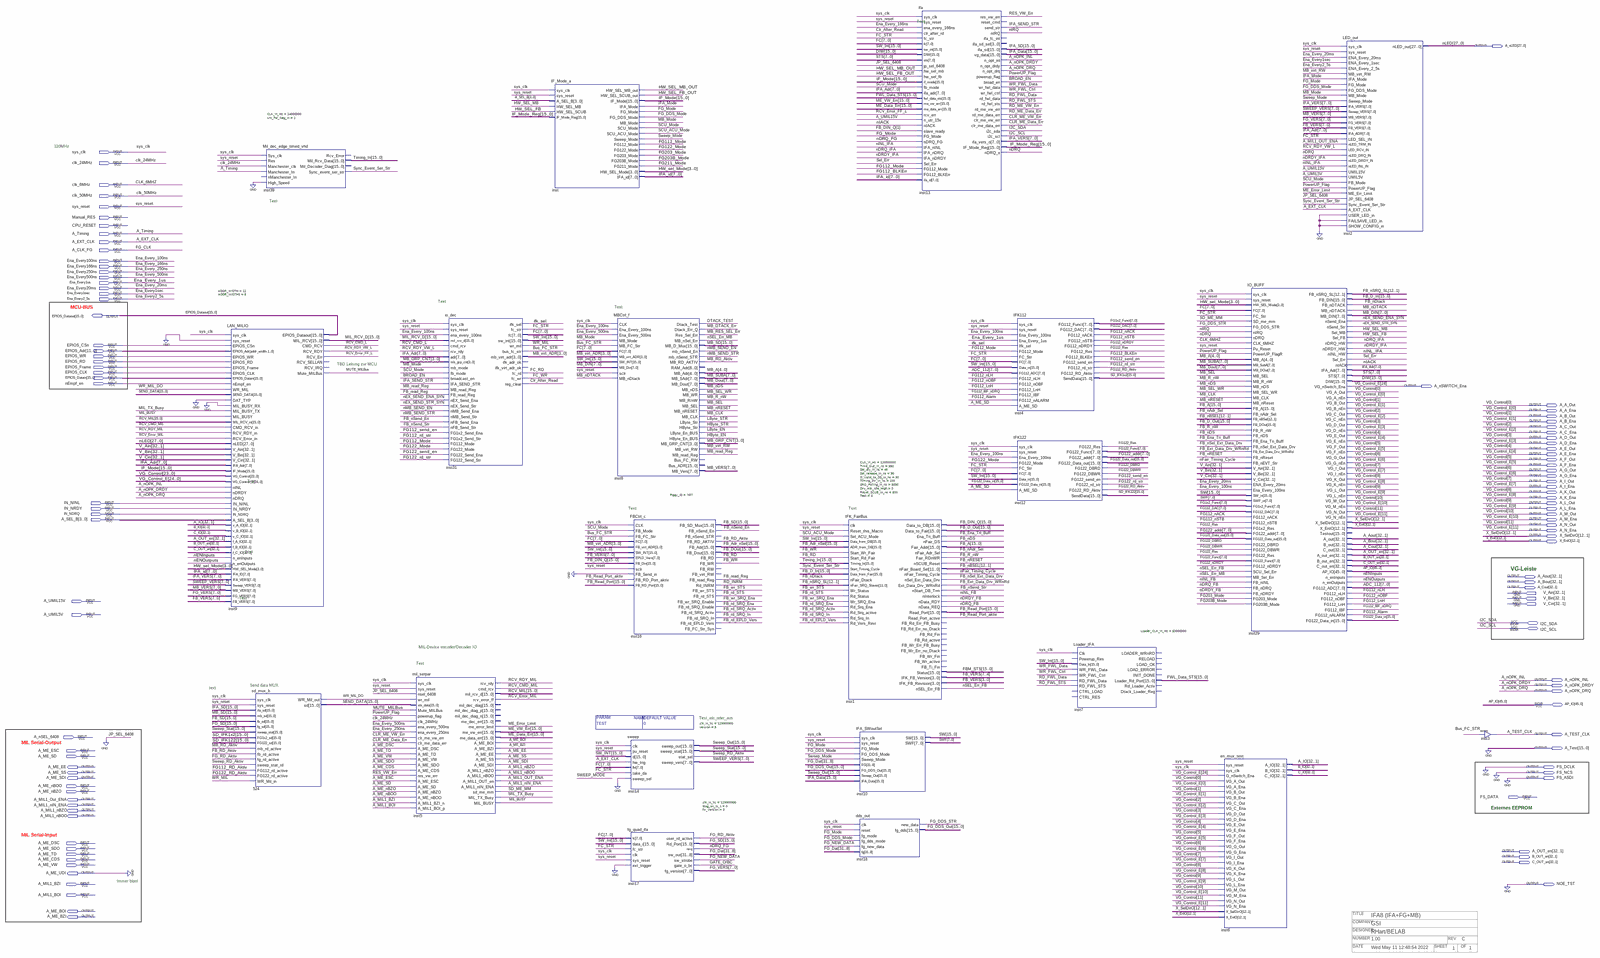
[diagram p0: schematic sheet, whole]
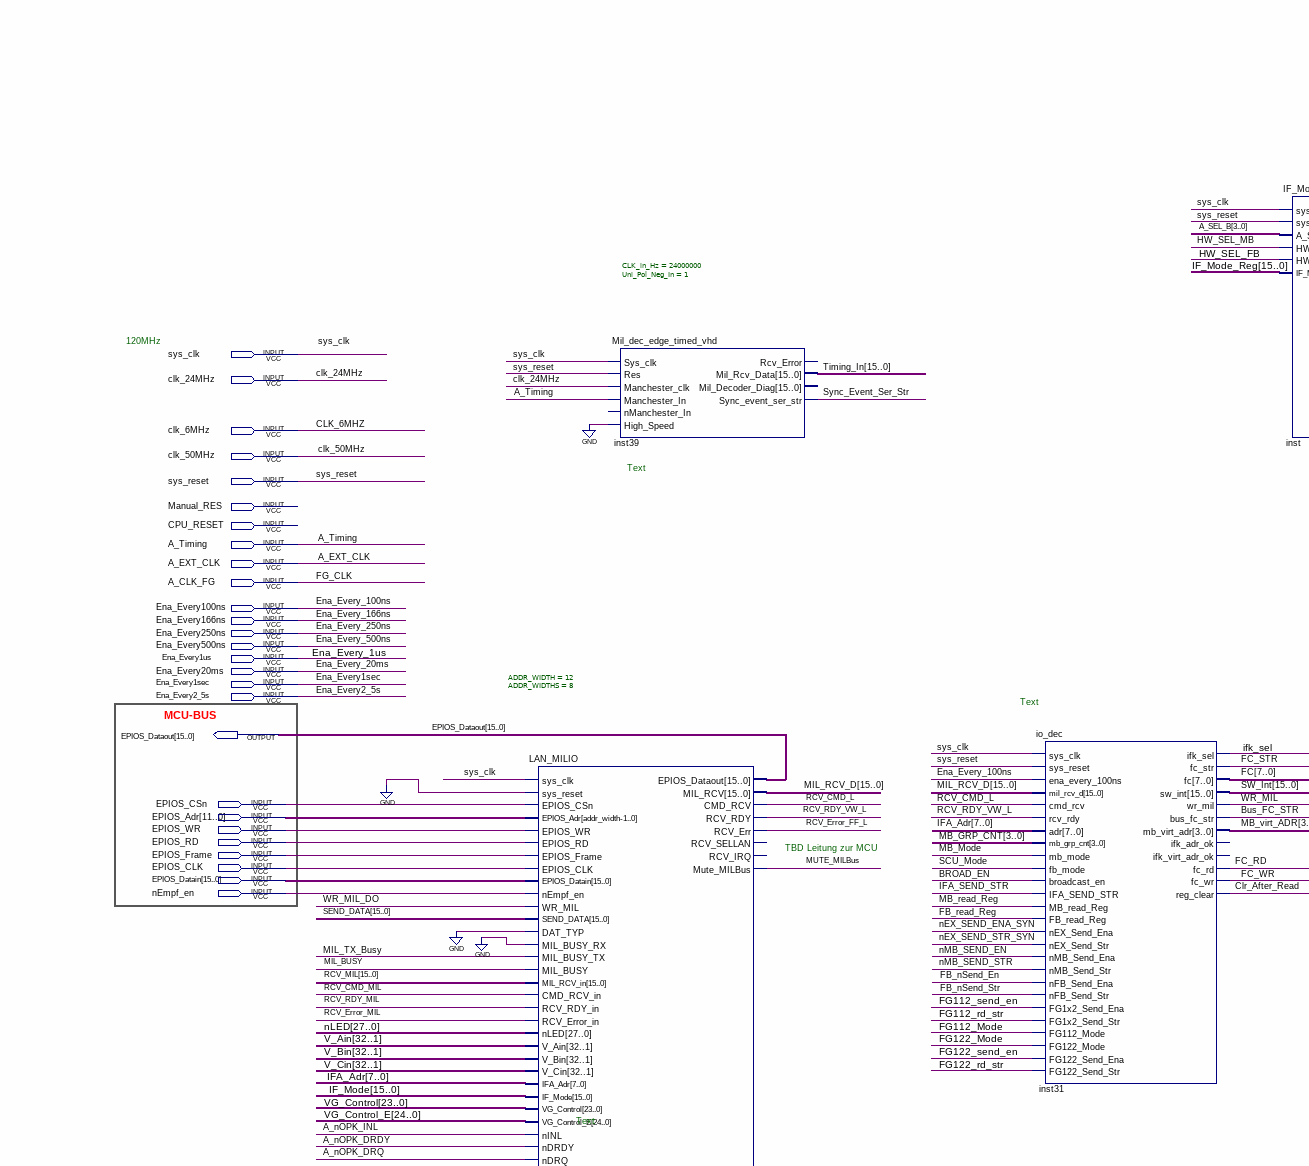
[diagram p1: schematic sheet, upper left part]
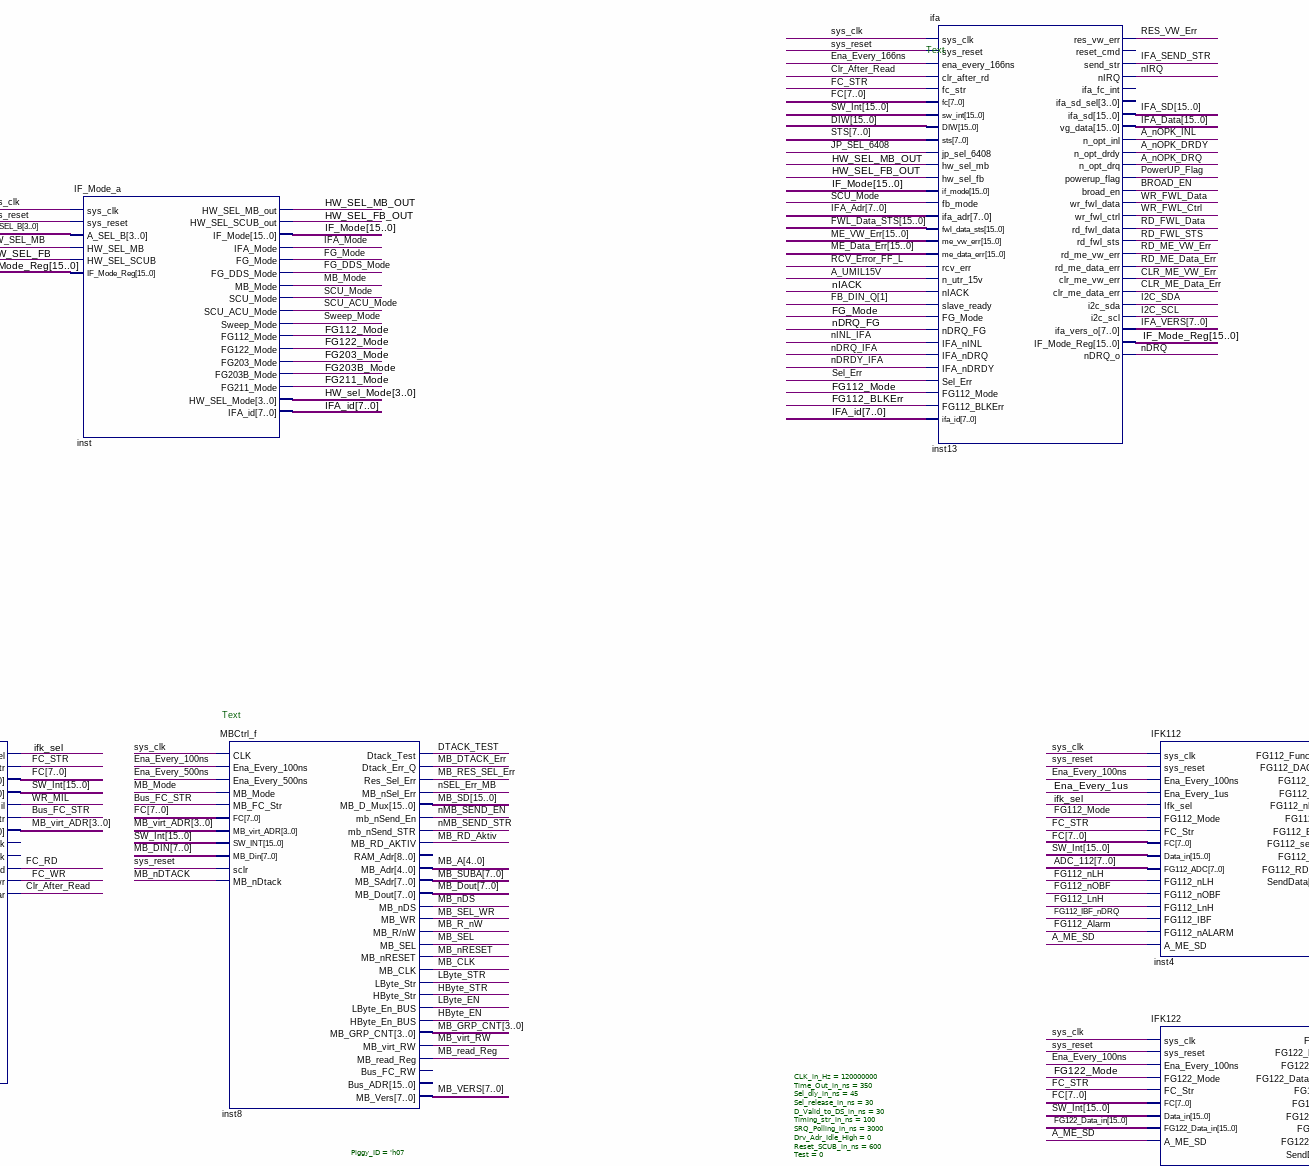
[diagram p2: schematic sheet, upper centre part]
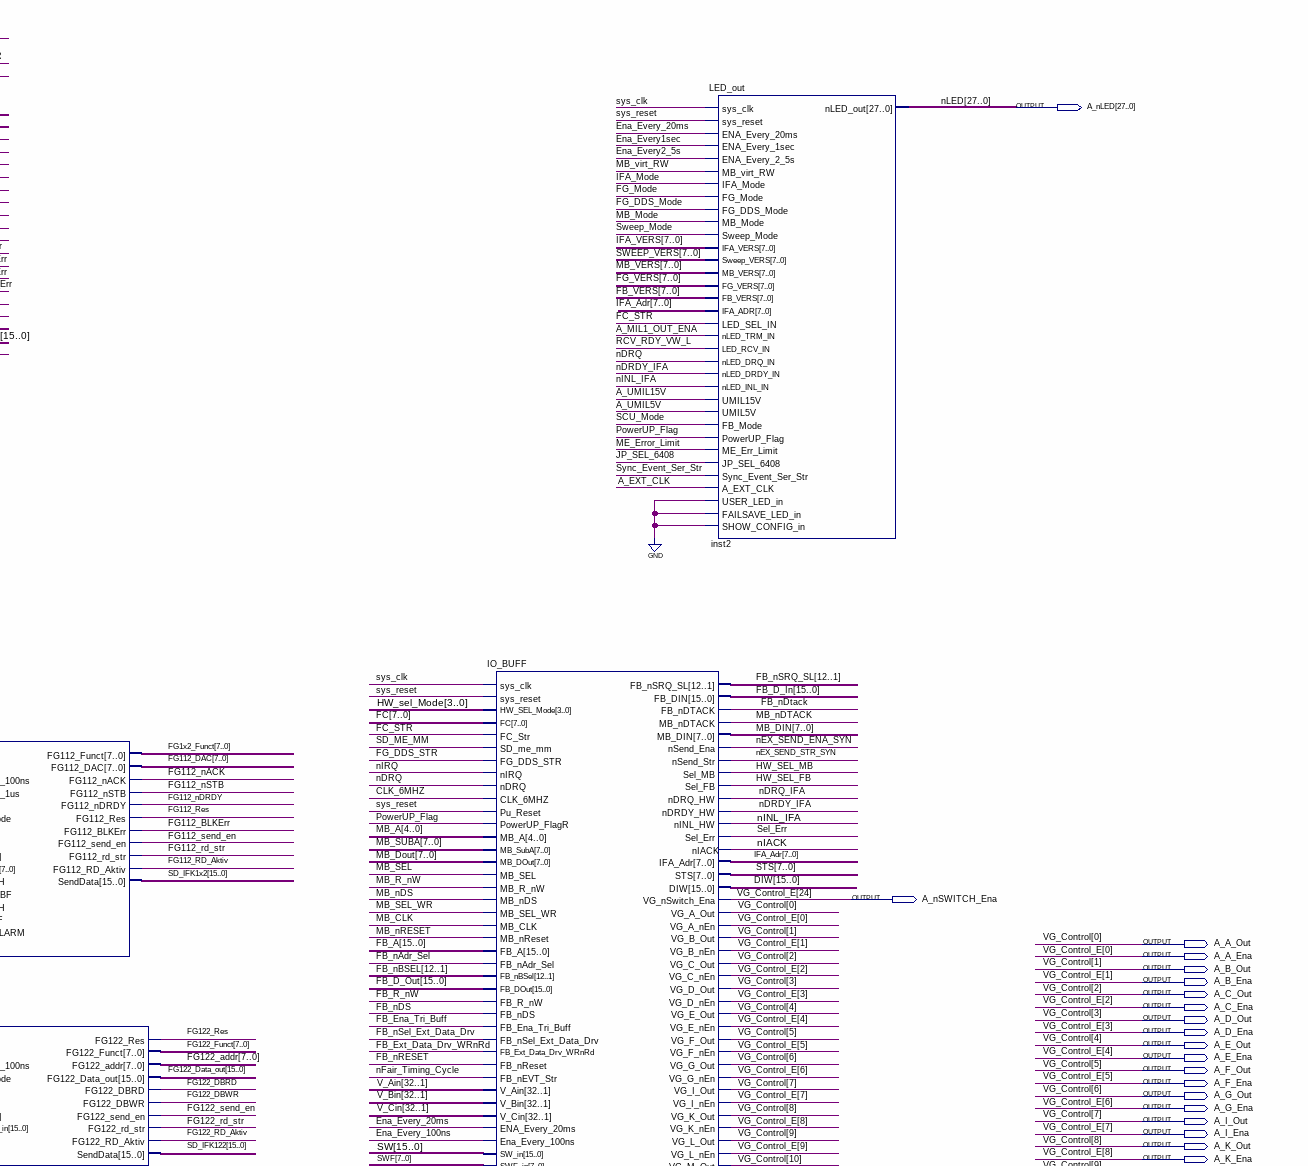
[diagram p3: schematic sheet, upper right part]
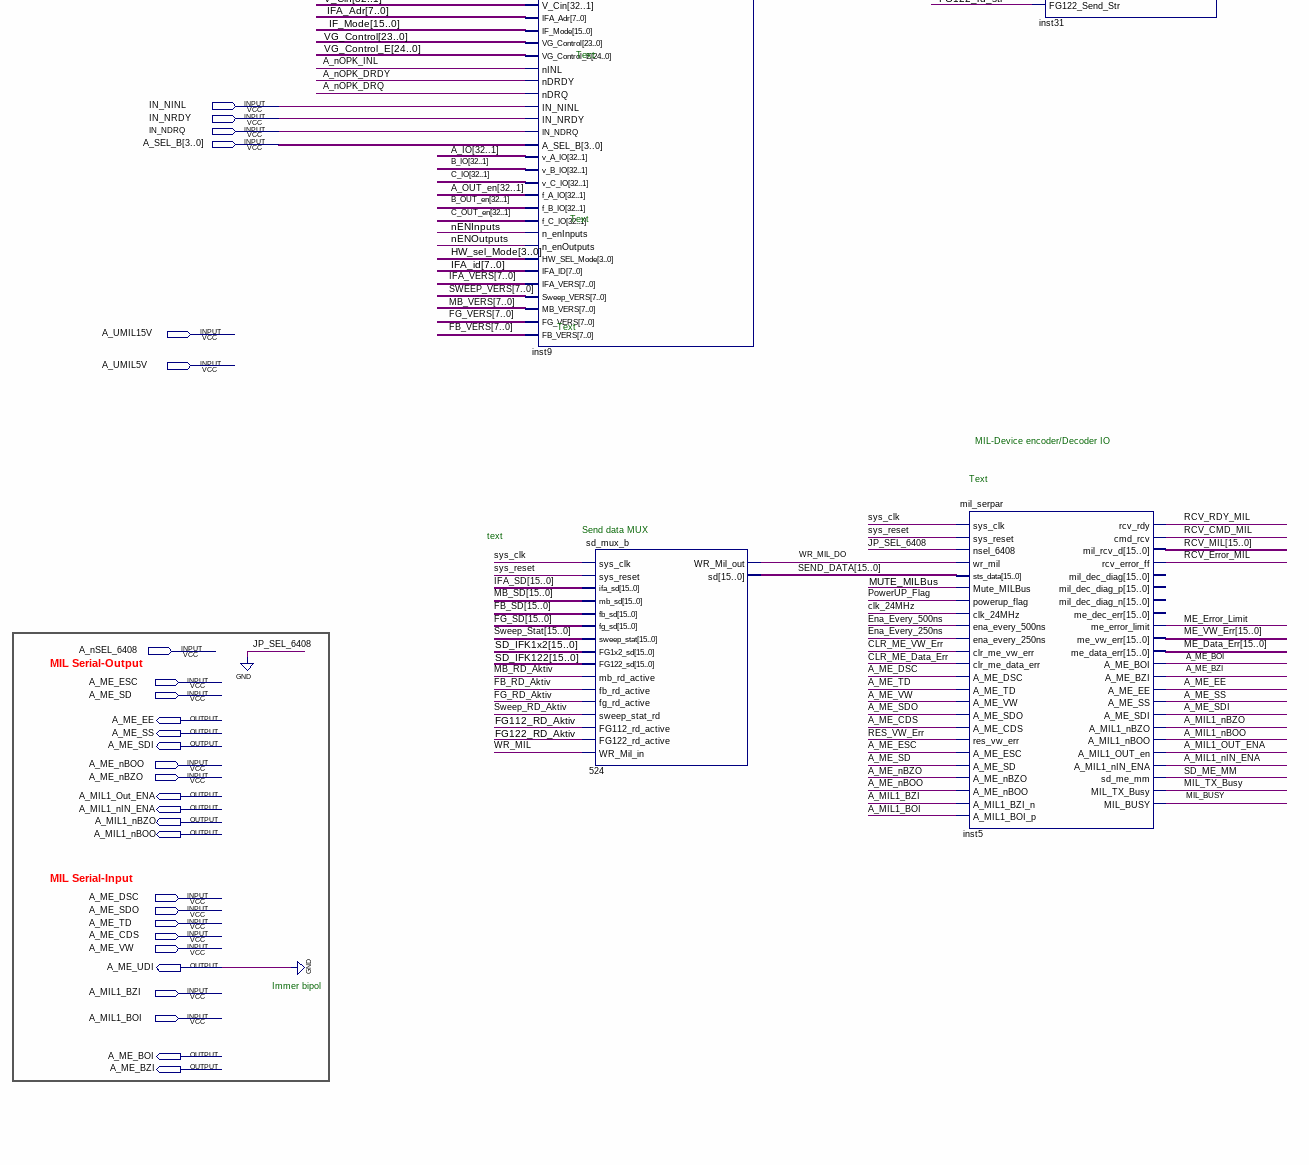
[diagram p4: schematic sheet, lower left part]
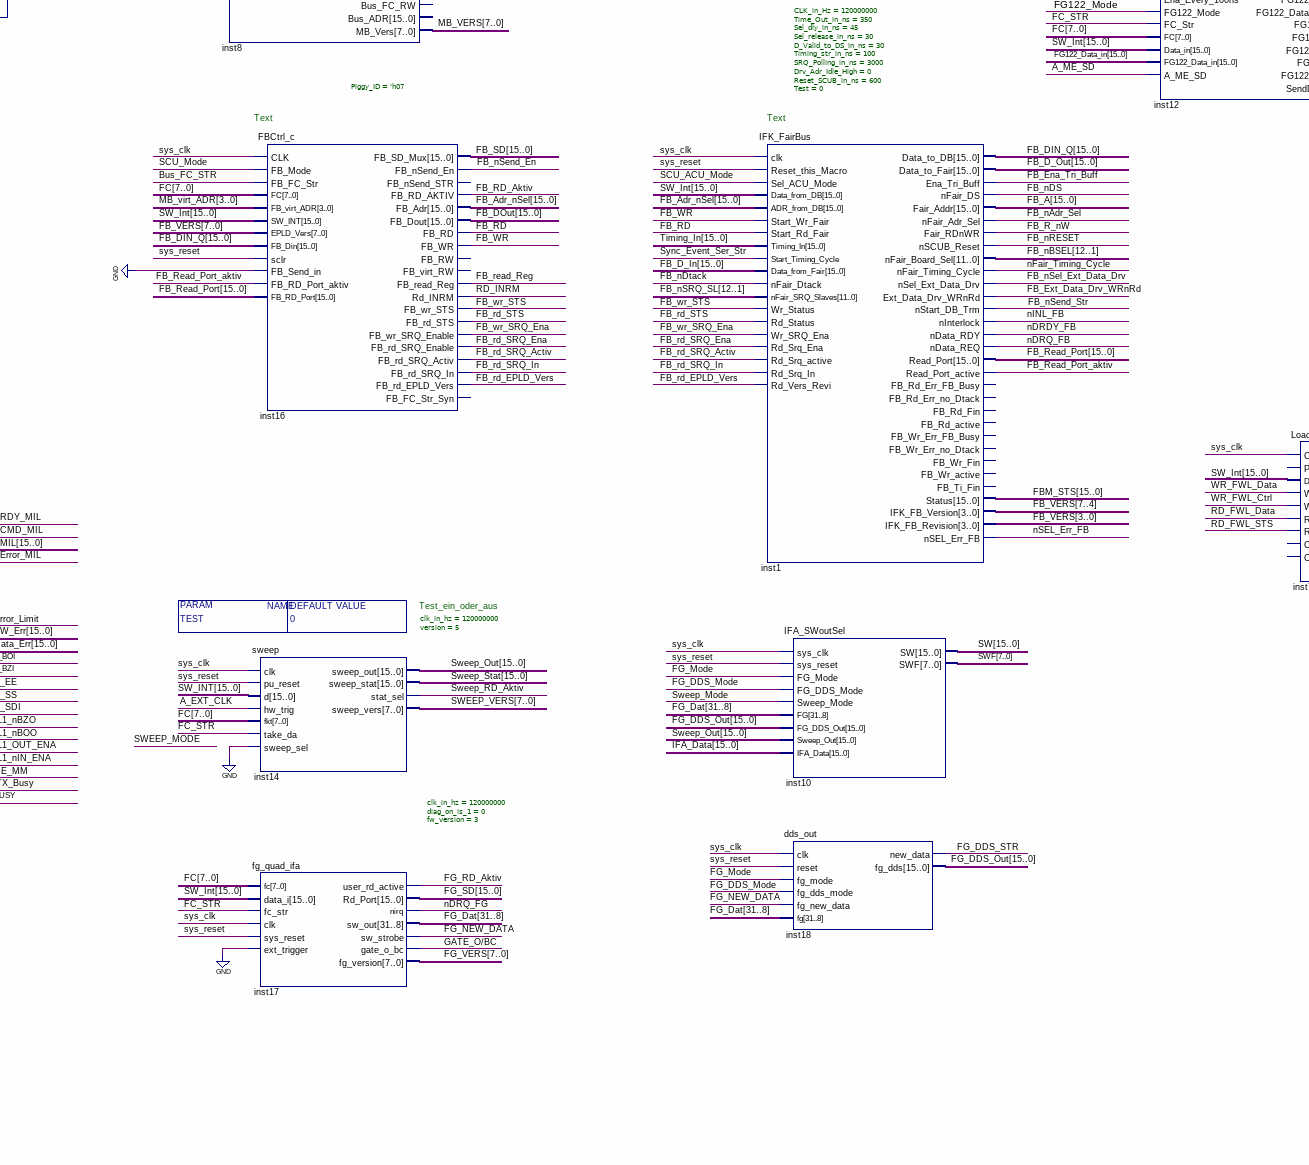
[diagram p5: schematic sheet, lower centre part]
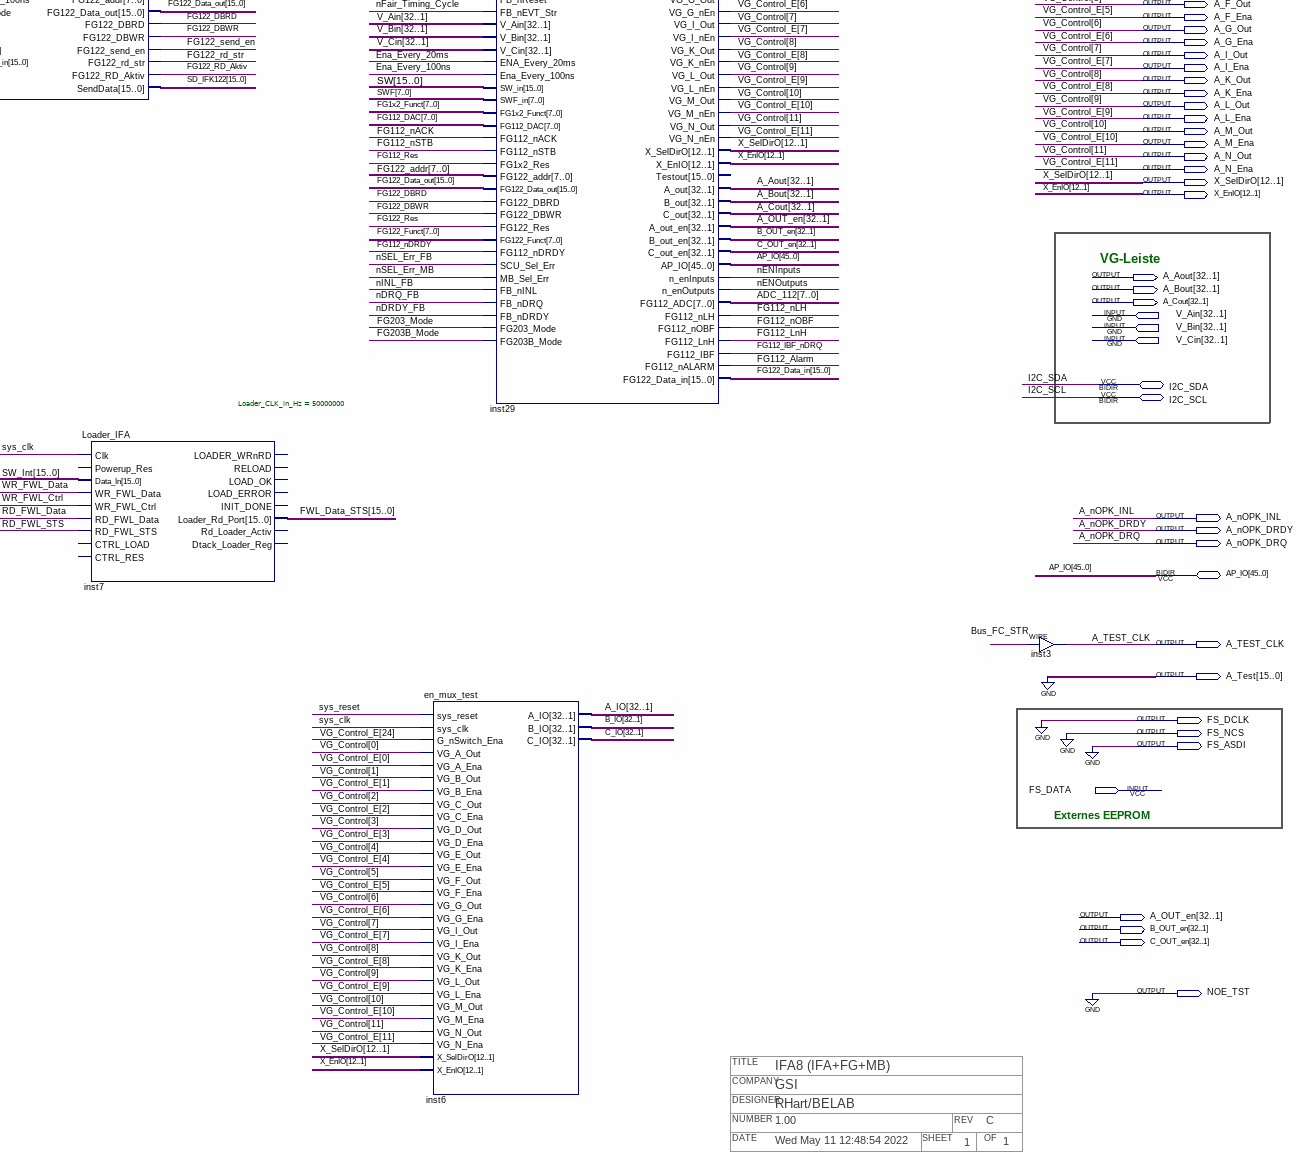
[diagram p6: schematic sheet, lower right part]
// Quartus schematic IFA8_X.bdf as structural Verilog: 21 symbols, 105 pins
// Title block: TITLE: IFA8 (IFA+FG+MB); COMPANY: GSI; DESIGNER: RHart/BELAB; NUMBER: 1.00; REV: C; DATE: Wed May 11 12:48:54 2022; SHEET: 1; OF: 1
module IFA8_X #(parameter TEST = 0) (
  input  sys_clk,
  input  clk_24MHz,
  input  clk_6MHz,
  input  clk_50MHz,
  input  sys_reset,
  input  Manual_RES,
  input  CPU_RESET,
  input  A_Timing,
  input  A_EXT_CLK,
  input  A_CLK_FG,
  input  Ena_Every100ns,
  input  Ena_Every166ns,
  input  Ena_Every250ns,
  input  Ena_Every500ns,
  input  Ena_Every1us,
  input  Ena_Every20ms,
  input  Ena_Every1sec,
  input  Ena_Every2_5s,
  input  EPIOS_CSn,
  input  [11:0] EPIOS_Adr,
  input  EPIOS_WR,
  input  EPIOS_RD,
  input  EPIOS_Frame,
  input  EPIOS_CLK,
  input  [15:0] EPIOS_Datain,
  input  nEmpf_en,
  input  IN_NINL,
  input  IN_NRDY,
  input  IN_NDRQ,
  input  [3:0] A_SEL_B,
  input  [32:1] V_Ain,
  input  [32:1] V_Bin,
  input  A_UMIL15V,
  input  [32:1] V_Cin,
  input  A_UMIL5V,
  input  A_nSEL_6408,
  input  A_ME_ESC,
  input  A_ME_SD,
  input  A_ME_nBOO,
  input  A_ME_nBZO,
  input  FS_DATA,
  input  A_ME_DSC,
  input  A_ME_SDO,
  input  A_ME_TD,
  input  A_ME_CDS,
  input  A_ME_VW,
  input  A_MIL1_BZI,
  input  A_MIL1_BOI,
  inout  I2C_SDA,
  inout  I2C_SCL,
  inout  [45:0] AP_IO,
  output [27:0] A_nLED,
  output [15:0] EPIOS_Dataout,
  output A_nSWITCH_Ena,
  output A_A_Out,
  output A_A_Ena,
  output A_B_Out,
  output A_B_Ena,
  output A_C_Out,
  output A_C_Ena,
  output A_D_Out,
  output A_D_Ena,
  output A_E_Out,
  output A_E_Ena,
  output A_F_Out,
  output A_F_Ena,
  output A_G_Out,
  output A_G_Ena,
  output A_I_Out,
  output A_I_Ena,
  output A_K_Out,
  output A_K_Ena,
  output A_L_Out,
  output A_L_Ena,
  output A_M_Out,
  output A_M_Ena,
  output A_N_Out,
  output A_N_Ena,
  output [12:1] X_SelDirO,
  output [12:1] X_EnIO,
  output [32:1] A_Aout,
  output [32:1] A_Bout,
  output [32:1] A_Cout,
  output A_nOPK_INL,
  output A_nOPK_DRDY,
  output A_nOPK_DRQ,
  output A_TEST_CLK,
  output [15:0] A_Test,
  output A_ME_EE,
  output FS_DCLK,
  output A_ME_SS,
  output FS_NCS,
  output A_ME_SDI,
  output FS_ASDI,
  output A_MIL1_Out_ENA,
  output A_MIL1_nIN_ENA,
  output A_MIL1_nBZO,
  output A_MIL1_nBOO,
  output [32:1] A_OUT_en,
  output [32:1] B_OUT_en,
  output [32:1] C_OUT_en,
  output A_ME_UDI,
  output NOE_TST,
  output A_ME_BOI,
  output A_ME_BZI
);

  wire BROAD_EN, Bus_FC_STR, Clr_After_Read, CLR_ME_Data_Err, CLR_ME_VW_Err, DTACK_TEST, FB_Ena_Tri_Buff,
       FB_Ext_Data_Drv_WRnRd, FB_nAdr_Sel, FB_nDS, FB_nDtack, FB_nRESET, FB_nSel_Ext_Data_Drv, FB_nSend_En,
       FB_nSend_Str, FB_R_nW, FB_RD, FB_RD_Aktiv, FB_rd_EPLD_Vers, FB_rd_SRQ_Activ, FB_rd_SRQ_Ena,
       FB_rd_SRQ_In, FB_rd_STS, FB_Read_Port_aktiv, FB_read_Reg, FB_WR, FB_wr_SRQ_Ena, FB_wr_STS, FC_RD,
       FC_STR, FC_WR, FG112_Alarm, FG112_BLKErr, FG112_IBF_nDRQ, FG112_LnH, FG112_Mode, FG112_nACK,
       FG112_nDRDY, FG112_nLH, FG112_nOBF, FG112_nSTB, FG112_RD_Aktiv, FG112_rd_str, FG112_Res,
       FG112_send_en, FG122_DBRD, FG122_DBWR, FG122_Mode, FG122_RD_Aktiv, FG122_rd_str, FG122_Res,
       FG122_send_en, FG203_Mode, FG203B_Mode, FG211_Mode, FG_DDS_Mode, FG_DDS_STR, FG_Mode, FG_NEW_DATA,
       FG_RD_Aktiv, \GATE_O/BC , HByte_EN, HByte_STR, HW_SEL_FB, HW_SEL_FB_OUT, HW_SEL_MB, HW_SEL_MB_OUT,
       IFA_Mode, IFA_SEND_STR, ifk_sel, LByte_EN, LByte_STR, MB_CLK, MB_DTACK_Err, MB_Mode, MB_nDS,
       MB_nDTACK, MB_nRESET, MB_R_nW, MB_RD_Aktiv, MB_read_Reg, MB_RES_SEL_Err, MB_SEL, MB_SEL_WR,
       MB_virt_RW, ME_Error_Limit, MIL_BUSY, MIL_TX_Busy, MUTE_MILBus, nDRDY_FB, nDRDY_IFA, nDRQ, nDRQ_FB,
       nDRQ_FG, nDRQ_IFA, nENInputs, nENOutputs, nEX_SEND_ENA_SYN, nEX_SEND_STR_SYN, nFair_Timing_Cycle,
       nIACK, nINL_FB, nINL_IFA, nIRQ, nMB_SEND_EN, nMB_SEND_STR, nSEL_Err_FB, nSEL_Err_MB, PowerUP_Flag,
       RCV_CMD_L, RCV_CMD_MIL, RCV_Error_FF_L, RCV_Error_MIL, RCV_RDY_MIL, RCV_RDY_VW_L, RD_FWL_Data,
       RD_FWL_STS, RD_INRM, RD_ME_Data_Err, RD_ME_VW_Err, RES_VW_Err, SCU_ACU_Mode, SCU_Mode, SD_ME_MM,
       Sel_Err, Sweep_Mode, Sweep_RD_Aktiv, Sync_Event_Ser_Str, WR_FWL_Ctrl, WR_FWL_Data, WR_MIL, WR_MIL_DO;
  wire [3:0] HW_sel_Mode, MB_GRP_CNT, MB_virt_ADR;
  wire [4:0] MB_A;
  wire [7:0] ADC_112, FB_VERS, FC, FG1x2_Funct, FG112_DAC, FG122_addr, FG122_Funct, FG_VERS, IFA_Adr, IFA_id,
       IFA_VERS, MB_DIN, MB_Dout, MB_SUBA, MB_VERS, STS, SWEEP_VERS, SWF;
  wire [12:1] FB_nBSEL, FB_nSRQ_SL;
  wire [15:0] DIW, FB_A, FB_Adr_nSel, FB_D_In, FB_D_Out, FB_DIN_Q, FB_DOut, FB_Read_Port, FB_SD, FBM_STS,
       FG122_Data_in, FG122_Data_out, FG_DDS_Out, FG_SD, FWL_Data_STS, IF_Mode, IF_Mode_Reg, IFA_Data,
       IFA_SD, MB_SD, ME_Data_Err, ME_VW_Err, MIL_RCV_D, RCV_MIL, SD_IFK1x2, SD_IFK122, SEND_DATA, SW,
       SW_Int, Sweep_Out, Sweep_Stat, Timing_In;
  wire [23:12] VG_Control, VG_Control_E;
  wire [31:8] FG_Dat;
  wire [32:1] A_IO, B_IO, C_IO;

  LAN_MILIO #(.ADDR_WIDTH(12), .ADDR_WIDTHS(8)) inst9 (
    .sys_clk(sys_clk), .sys_reset(1'b0), .EPIOS_CSn(EPIOS_CSn), .EPIOS_Adr(EPIOS_Adr), .EPIOS_WR(EPIOS_WR),
    .EPIOS_RD(EPIOS_RD), .EPIOS_Frame(EPIOS_Frame), .EPIOS_CLK(EPIOS_CLK), .EPIOS_Datain(EPIOS_Datain),
    .nEmpf_en(nEmpf_en), .WR_MIL(WR_MIL_DO), .SEND_DATA(SEND_DATA), .DAT_TYP(1'b0), .MIL_BUSY_RX(1'b0),
    .MIL_BUSY_TX(MIL_TX_Busy), .MIL_BUSY(MIL_BUSY), .MIL_RCV_in(RCV_MIL), .CMD_RCV_in(RCV_CMD_MIL),
    .RCV_RDY_in(RCV_RDY_MIL), .RCV_Error_in(RCV_Error_MIL), .nLED(A_nLED), .V_Ain(V_Ain), .V_Bin(V_Bin),
    .V_Cin(V_Cin), .IFA_Adr(IFA_Adr), .IF_Mode(IF_Mode),
    .VG_Control({VG_Control, A_N_Out, A_M_Out, A_L_Out, A_K_Out, A_I_Out, A_G_Out, A_F_Out, A_E_Out, A_D_Out, A_C_Out, A_B_Out, A_A_Out}),
    .VG_Control_E({A_nSWITCH_Ena, VG_Control_E, A_N_Ena, A_M_Ena, A_L_Ena, A_K_Ena, A_I_Ena, A_G_Ena, A_F_Ena, A_E_Ena, A_D_Ena, A_C_Ena, A_B_Ena, A_A_Ena}),
    .nINL(A_nOPK_INL), .nDRDY(A_nOPK_DRDY), .nDRQ(A_nOPK_DRQ), .IN_NINL(IN_NINL), .IN_NRDY(IN_NRDY),
    .IN_NDRQ(IN_NDRQ), .A_SEL_B(A_SEL_B), .v_A_IO(A_IO), .v_B_IO(B_IO), .v_C_IO(C_IO), .f_A_IO(A_OUT_en),
    .f_B_IO(B_OUT_en), .f_C_IO(C_OUT_en), .n_enInputs(nENInputs), .n_enOutputs(nENOutputs),
    .HW_SEL_Mode(HW_sel_Mode), .IFA_ID(IFA_id), .IFA_VERS(IFA_VERS), .Sweep_VERS(SWEEP_VERS),
    .MB_VERS(MB_VERS), .FG_VERS(FG_VERS), .FB_VERS(FB_VERS), .EPIOS_Dataout(EPIOS_Dataout),
    .MIL_RCV(MIL_RCV_D), .CMD_RCV(RCV_CMD_L), .RCV_RDY(RCV_RDY_VW_L), .RCV_Err(RCV_Error_FF_L),
    .Mute_MILBus(MUTE_MILBus));  // open: RCV_SELLAN, RCV_IRQ
  Mil_dec_edge_timed_vhd #(.CLK_in_Hz(24000000), .Uni_Pol_Neg_In(1)) inst39 (
    .Sys_clk(sys_clk), .Res(sys_reset), .Manchester_clk(clk_24MHz), .Manchester_In(A_Timing),
    .High_Speed(1'b0), .Mil_Rcv_Data(Timing_In), .Sync_event_ser_str(Sync_Event_Ser_Str));  // open: nManchester_In, Rcv_Error, Mil_Decoder_Diag
  sd_mux_b u_524 (
    .sys_clk(sys_clk), .sys_reset(sys_reset), .ifa_sd(IFA_SD), .mb_sd(MB_SD), .fb_sd(FB_SD), .fg_sd(FG_SD),
    .sweep_stat(Sweep_Stat), .FG1x2_sd(SD_IFK1x2), .FG122_sd(SD_IFK122), .mb_rd_active(MB_RD_Aktiv),
    .fb_rd_active(FB_RD_Aktiv), .fg_rd_active(FG_RD_Aktiv), .sweep_stat_rd(Sweep_RD_Aktiv),
    .FG112_rd_active(FG112_RD_Aktiv), .FG122_rd_active(FG122_RD_Aktiv), .WR_Mil_in(WR_MIL),
    .WR_Mil_out(WR_MIL_DO), .sd(SEND_DATA));
  mil_serpar inst5 (
    .sys_clk(sys_clk), .sys_reset(sys_reset), .nsel_6408(1'b0), .wr_mil(WR_MIL_DO), .sts_data(SEND_DATA),
    .Mute_MILBus(MUTE_MILBus), .powerup_flag(PowerUP_Flag), .clk_24MHz(clk_24MHz),
    .ena_every_500ns(Ena_Every500ns), .ena_every_250ns(Ena_Every250ns), .clr_me_vw_err(CLR_ME_VW_Err),
    .clr_me_data_err(CLR_ME_Data_Err), .A_ME_DSC(A_ME_DSC), .A_ME_TD(A_ME_TD), .A_ME_VW(A_ME_VW),
    .A_ME_SDO(A_ME_SDO), .A_ME_CDS(A_ME_CDS), .res_vw_err(RES_VW_Err), .A_ME_ESC(A_ME_ESC),
    .A_ME_SD(A_ME_SD), .A_ME_nBZO(A_ME_nBZO), .A_ME_nBOO(A_ME_nBOO), .A_MIL1_BZI_n(A_MIL1_BZI),
    .A_MIL1_BOI_p(A_MIL1_BOI), .rcv_rdy(RCV_RDY_MIL), .cmd_rcv(RCV_CMD_MIL), .mil_rcv_d(RCV_MIL),
    .rcv_error_ff(RCV_Error_MIL), .me_error_limit(ME_Error_Limit), .me_vw_err(ME_VW_Err),
    .me_data_err(ME_Data_Err), .A_ME_BOI(A_ME_BOI), .A_ME_BZI(A_ME_BZI), .A_ME_EE(A_ME_EE),
    .A_ME_SS(A_ME_SS), .A_ME_SDI(A_ME_SDI), .A_MIL1_nBZO(A_MIL1_nBZO), .A_MIL1_nBOO(A_MIL1_nBOO),
    .A_MIL1_OUT_en(A_MIL1_Out_ENA), .A_MIL1_nIN_ENA(A_MIL1_nIN_ENA), .sd_me_mm(SD_ME_MM),
    .MIL_TX_Busy(MIL_TX_Busy), .MIL_BUSY(MIL_BUSY));  // open: mil_dec_diag, mil_dec_diag_p, mil_dec_diag_n, me_dec_err
  io_dec inst31 (
    .sys_clk(sys_clk), .sys_reset(sys_reset), .ena_every_100ns(Ena_Every100ns), .mil_rcv_d(MIL_RCV_D),
    .cmd_rcv(RCV_CMD_L), .rcv_rdy(RCV_RDY_VW_L), .adr(IFA_Adr), .mb_grp_cnt(MB_GRP_CNT), .mb_mode(MB_Mode),
    .fb_mode(SCU_Mode), .broadcast_en(BROAD_EN), .IFA_SEND_STR(IFA_SEND_STR), .MB_read_Reg(MB_read_Reg),
    .FB_read_Reg(FB_read_Reg), .nEX_Send_Ena(nEX_SEND_ENA_SYN), .nEX_Send_Str(nEX_SEND_STR_SYN),
    .nMB_Send_Ena(nMB_SEND_EN), .nMB_Send_Str(nMB_SEND_STR), .nFB_Send_Ena(FB_nSend_En),
    .nFB_Send_Str(FB_nSend_Str), .FG1x2_Send_Ena(FG112_send_en), .FG1x2_Send_Str(FG112_rd_str),
    .FG112_Mode(FG112_Mode), .FG122_Mode(FG122_Mode), .FG122_Send_Ena(FG122_send_en),
    .FG122_Send_Str(FG122_rd_str), .ifk_sel(ifk_sel), .fc_str(FC_STR), .fc(FC), .sw_int(SW_Int),
    .wr_mil(WR_MIL), .bus_fc_str(Bus_FC_STR), .mb_virt_adr(MB_virt_ADR), .fc_rd(FC_RD), .fc_wr(FC_WR),
    .reg_clear(Clr_After_Read));  // open: ifk_adr_ok, ifk_virt_adr_ok
  IF_Mode_a inst (
    .sys_clk(sys_clk), .sys_reset(sys_reset), .A_SEL_B(A_SEL_B), .HW_SEL_MB(HW_SEL_MB),
    .HW_SEL_SCUB(HW_SEL_FB), .IF_Mode_Reg(IF_Mode_Reg), .HW_SEL_MB_out(HW_SEL_MB_OUT),
    .HW_SEL_SCUB_out(HW_SEL_FB_OUT), .IF_Mode(IF_Mode), .IFA_Mode(IFA_Mode), .FG_Mode(FG_Mode),
    .FG_DDS_Mode(FG_DDS_Mode), .MB_Mode(MB_Mode), .SCU_Mode(SCU_Mode), .SCU_ACU_Mode(SCU_ACU_Mode),
    .Sweep_Mode(Sweep_Mode), .FG112_Mode(FG112_Mode), .FG122_Mode(FG122_Mode), .FG203_Mode(FG203_Mode),
    .FG203B_Mode(FG203B_Mode), .FG211_Mode(FG211_Mode), .HW_SEL_Mode(HW_sel_Mode), .IFA_id(IFA_id));
  MBCtrl_f inst8 (
    .CLK(sys_clk), .Ena_Every_100ns(Ena_Every100ns), .Ena_Every_500ns(Ena_Every500ns), .MB_Mode(MB_Mode),
    .MB_FC_Str(Bus_FC_STR), .FC(FC), .MB_virt_ADR(MB_virt_ADR), .SW_INT(SW_Int), .MB_Din(MB_DIN),
    .sclr(sys_reset), .MB_nDtack(MB_nDTACK), .Dtack_Test(DTACK_TEST), .Dtack_Err_Q(MB_DTACK_Err),
    .Res_Sel_Err(MB_RES_SEL_Err), .MB_nSel_Err(nSEL_Err_MB), .MB_D_Mux(MB_SD), .mb_nSend_En(nMB_SEND_EN),
    .mb_nSend_STR(nMB_SEND_STR), .MB_RD_AKTIV(MB_RD_Aktiv), .MB_Adr(MB_A), .MB_SAdr(MB_SUBA),
    .MB_Dout(MB_Dout), .MB_nDS(MB_nDS), .MB_WR(MB_SEL_WR), .\MB_R/nW (MB_R_nW), .MB_SEL(MB_SEL),
    .MB_nRESET(MB_nRESET), .MB_CLK(MB_CLK), .LByte_Str(LByte_STR), .HByte_Str(HByte_STR),
    .LByte_En_BUS(LByte_EN), .HByte_En_BUS(HByte_EN), .MB_GRP_CNT(MB_GRP_CNT), .MB_virt_RW(MB_virt_RW),
    .MB_read_Reg(MB_read_Reg), .MB_Vers(MB_VERS));  // open: RAM_Adr, Bus_FC_RW, Bus_ADR
  FBCtrl_c #(.Piggy_ID('h07)) inst16 (
    .CLK(sys_clk), .FB_Mode(SCU_Mode), .FB_FC_Str(Bus_FC_STR), .FC(FC), .FB_virt_ADR(MB_virt_ADR),
    .SW_INT(SW_Int), .EPLD_Vers(FB_VERS), .FB_Din(FB_DIN_Q), .sclr(sys_reset), .FB_Send_in(1'b0),
    .FB_RD_Port_aktiv(FB_Read_Port_aktiv), .FB_RD_Port(FB_Read_Port), .FB_SD_Mux(FB_SD),
    .FB_nSend_En(FB_nSend_En), .FB_RD_AKTIV(FB_RD_Aktiv), .FB_Adr(FB_Adr_nSel), .FB_Dout(FB_DOut),
    .FB_RD(FB_RD), .FB_WR(FB_WR), .FB_read_Reg(FB_read_Reg), .Rd_INRM(RD_INRM), .FB_wr_STS(FB_wr_STS),
    .FB_rd_STS(FB_rd_STS), .FB_wr_SRQ_Enable(FB_wr_SRQ_Ena), .FB_rd_SRQ_Enable(FB_rd_SRQ_Ena),
    .FB_rd_SRQ_Activ(FB_rd_SRQ_Activ), .FB_rd_SRQ_In(FB_rd_SRQ_In), .FB_rd_EPLD_Vers(FB_rd_EPLD_Vers));  // open: FB_nSend_STR, FB_RW, FB_virt_RW, FB_FC_Str_Syn
  sweep #(.clk_in_hz(120000000), .version(5)) inst14 (
    .clk(sys_clk), .pu_reset(sys_reset), .d(SW_Int), .hw_trig(A_EXT_CLK), .fkt(FC), .take_da(FC_STR),
    .sweep_sel(1'b0), .sweep_out(Sweep_Out), .sweep_stat(Sweep_Stat), .stat_sel(Sweep_RD_Aktiv),
    .sweep_vers(SWEEP_VERS));
  fg_quad_ifa #(.clk_in_hz(120000000), .diag_on_is_1(0), .fw_version(3)) inst17 (
    .fc(FC), .data_i(SW_Int), .fc_str(FC_STR), .clk(sys_clk), .sys_reset(sys_reset), .ext_trigger(1'b0),
    .user_rd_active(FG_RD_Aktiv), .Rd_Port(FG_SD), .nirq(nDRQ_FG), .sw_out(FG_Dat), .sw_strobe(FG_NEW_DATA),
    .gate_o_bc(\GATE_O/BC ), .fg_version(FG_VERS));
  IFK_FairBus #(.CLK_in_Hz(120000000), .Time_Out_in_ns(350), .Sel_dly_in_ns(45), .Sel_release_in_ns(30), .D_Valid_to_DS_in_ns(30), .Timing_str_in_ns(100), .SRQ_Polling_in_ns(3000), .Drv_Adr_Idle_High(0), .Reset_SCUB_in_ns(600), .Test(0)) inst1 (
    .clk(sys_clk), .Reset_this_Macro(sys_reset), .Sel_ACU_Mode(SCU_ACU_Mode), .Data_from_DB(SW_Int),
    .ADR_from_DB(FB_Adr_nSel), .Start_Wr_Fair(FB_WR), .Start_Rd_Fair(FB_RD), .Timing_In(Timing_In),
    .Start_Timing_Cycle(Sync_Event_Ser_Str), .Data_from_Fair(FB_D_In), .nFair_Dtack(FB_nDtack),
    .nFair_SRQ_Slaves(FB_nSRQ_SL), .Wr_Status(FB_wr_STS), .Rd_Status(FB_rd_STS), .Wr_SRQ_Ena(FB_wr_SRQ_Ena),
    .Rd_Srq_Ena(FB_rd_SRQ_Ena), .Rd_Srq_active(FB_rd_SRQ_Activ), .Rd_Srq_In(FB_rd_SRQ_In),
    .Rd_Vers_Revi(FB_rd_EPLD_Vers), .Data_to_DB(FB_DIN_Q), .Data_to_Fair(FB_D_Out),
    .Ena_Tri_Buff(FB_Ena_Tri_Buff), .nFair_DS(FB_nDS), .Fair_Addr(FB_A), .nFair_Adr_Sel(FB_nAdr_Sel),
    .Fair_RDnWR(FB_R_nW), .nSCUB_Reset(FB_nRESET), .nFair_Board_Sel(FB_nBSEL),
    .nFair_Timing_Cycle(nFair_Timing_Cycle), .nSel_Ext_Data_Drv(FB_nSel_Ext_Data_Drv),
    .Ext_Data_Drv_WRnRd(FB_Ext_Data_Drv_WRnRd), .nStart_DB_Trm(FB_nSend_Str), .nInterlock(nINL_FB),
    .nData_RDY(nDRDY_FB), .nData_REQ(nDRQ_FB), .Read_Port(FB_Read_Port),
    .Read_Port_active(FB_Read_Port_aktiv), .Status(FBM_STS), .IFK_FB_Version(FB_VERS[7:4]),
    .IFK_FB_Revision(FB_VERS[3:0]), .nSEL_Err_FB(nSEL_Err_FB));  // open: FB_Rd_Err_FB_Busy, FB_Rd_Err_no_Dtack, FB_Rd_Fin, FB_Rd_active, FB_Wr_Err_FB_Busy, FB_Wr_Err_no_Dtack, FB_Wr_Fin, FB_Wr_active, FB_Ti_Fin
  IFA_SWoutSel inst10 (
    .sys_clk(sys_clk), .sys_reset(sys_reset), .FG_Mode(FG_Mode), .FG_DDS_Mode(FG_DDS_Mode),
    .Sweep_Mode(Sweep_Mode), .FG(FG_Dat), .FG_DDS_Out(FG_DDS_Out), .Sweep_Out(Sweep_Out),
    .IFA_Data(IFA_Data), .SW(SW), .SWF(SWF));
  dds_out inst18 (
    .clk(sys_clk), .reset(sys_reset), .fg_mode(FG_Mode), .fg_dds_mode(FG_DDS_Mode),
    .fg_new_data(FG_NEW_DATA), .fg(FG_Dat), .new_data(FG_DDS_STR), .fg_dds(FG_DDS_Out));
  ifa inst13 (
    .sys_clk(sys_clk), .sys_reset(sys_reset), .ena_every_166ns(Ena_Every166ns),
    .clr_after_rd(Clr_After_Read), .fc_str(FC_STR), .fc(FC), .sw_int(SW_Int), .DIW(DIW), .sts(STS),
    .jp_sel_6408(1'b0), .hw_sel_mb(HW_SEL_MB_OUT), .hw_sel_fb(HW_SEL_FB_OUT), .if_mode(IF_Mode),
    .fb_mode(SCU_Mode), .ifa_adr(IFA_Adr), .fwl_data_sts(FWL_Data_STS), .me_vw_err(ME_VW_Err),
    .me_data_err(ME_Data_Err), .rcv_err(RCV_Error_FF_L), .n_utr_15v(A_UMIL15V), .nIACK(nIACK),
    .slave_ready(FB_DIN_Q[1]), .FG_Mode(FG_Mode), .nDRQ_FG(nDRQ_FG), .IFA_nINL(nINL_IFA),
    .IFA_nDRQ(nDRQ_IFA), .IFA_nDRDY(nDRDY_IFA), .Sel_Err(Sel_Err), .FG112_Mode(FG112_Mode),
    .FG112_BLKErr(FG112_BLKErr), .ifa_id(IFA_id), .res_vw_err(RES_VW_Err), .send_str(IFA_SEND_STR),
    .nIRQ(nIRQ), .ifa_sd(IFA_SD), .vg_data(IFA_Data), .n_opt_inl(A_nOPK_INL), .n_opt_drdy(A_nOPK_DRDY),
    .n_opt_drq(A_nOPK_DRQ), .powerup_flag(PowerUP_Flag), .broad_en(BROAD_EN), .wr_fwl_data(WR_FWL_Data),
    .wr_fwl_ctrl(WR_FWL_Ctrl), .rd_fwl_data(RD_FWL_Data), .rd_fwl_sts(RD_FWL_STS),
    .rd_me_vw_err(RD_ME_VW_Err), .rd_me_data_err(RD_ME_Data_Err), .clr_me_vw_err(CLR_ME_VW_Err),
    .clr_me_data_err(CLR_ME_Data_Err), .ifa_vers_o(IFA_VERS), .IF_Mode_Reg(IF_Mode_Reg), .nDRQ_o(nDRQ),
    .i2c_sda(I2C_SDA), .i2c_scl(I2C_SCL));  // open: reset_cmd, ifa_fc_int, ifa_sd_sel
  IFK112 inst4 (
    .sys_clk(sys_clk), .sys_reset(sys_reset), .Ena_Every_100ns(Ena_Every100ns), .Ena_Every_1us(Ena_Every1us),
    .Ifk_sel(ifk_sel), .FG112_Mode(FG112_Mode), .FC_Str(FC_STR), .FC(FC), .Data_in(SW_Int),
    .FG112_ADC(ADC_112), .FG112_nLH(FG112_nLH), .FG112_nOBF(FG112_nOBF), .FG112_LnH(FG112_LnH),
    .FG112_IBF(FG112_IBF_nDRQ), .FG112_nALARM(FG112_Alarm), .A_ME_SD(A_ME_SD), .FG112_Funct(FG1x2_Funct),
    .FG112_DAC(FG112_DAC), .FG112_nACK(FG112_nACK), .FG112_nSTB(FG112_nSTB), .FG112_nDRDY(FG112_nDRDY),
    .FG112_Res(FG112_Res), .FG112_BLKErr(FG112_BLKErr), .FG112_send_en(FG112_send_en),
    .FG112_rd_str(FG112_rd_str), .FG112_RD_Aktiv(FG112_RD_Aktiv), .SendData(SD_IFK1x2));
  IFK122 inst12 (
    .sys_clk(sys_clk), .sys_reset(sys_reset), .Ena_Every_100ns(Ena_Every100ns), .FG122_Mode(FG122_Mode),
    .FC_Str(FC_STR), .FC(FC), .Data_in(SW_Int), .FG122_Data_in(FG122_Data_in), .A_ME_SD(A_ME_SD),
    .FG122_Res(FG122_Res), .FG122_Funct(FG122_Funct), .FG122_addr(FG122_addr),
    .FG122_Data_out(FG122_Data_out), .FG122_DBRD(FG122_DBRD), .FG122_DBWR(FG122_DBWR),
    .FG122_send_en(FG122_send_en), .FG122_rd_str(FG122_rd_str), .FG122_RD_Aktiv(FG122_RD_Aktiv),
    .SendData(SD_IFK122));
  Loader_IFA #(.Loader_CLK_in_Hz(50000000)) inst7 (
    .Clk(sys_clk), .Data_In(SW_Int), .WR_FWL_Data(WR_FWL_Data), .WR_FWL_Ctrl(WR_FWL_Ctrl),
    .RD_FWL_Data(RD_FWL_Data), .RD_FWL_STS(RD_FWL_STS), .Loader_Rd_Port(FWL_Data_STS));  // open: Powerup_Res, CTRL_LOAD, CTRL_RES, LOADER_WRnRD, RELOAD, LOAD_OK, LOAD_ERROR, INIT_DONE, Rd_Loader_Activ, Dtack_Loader_Reg
  en_mux_test inst6 (
    .sys_reset(sys_reset), .sys_clk(sys_clk), .G_nSwitch_Ena(A_nSWITCH_Ena), .VG_A_Out(A_A_Out),
    .VG_A_Ena(A_A_Ena), .VG_B_Out(A_B_Out), .VG_B_Ena(A_B_Ena), .VG_C_Out(A_C_Out), .VG_C_Ena(A_C_Ena),
    .VG_D_Out(A_D_Out), .VG_D_Ena(A_D_Ena), .VG_E_Out(A_E_Out), .VG_E_Ena(A_E_Ena), .VG_F_Out(A_F_Out),
    .VG_F_Ena(A_F_Ena), .VG_G_Out(A_G_Out), .VG_G_Ena(A_G_Ena), .VG_I_Out(A_I_Out), .VG_I_Ena(A_I_Ena),
    .VG_K_Out(A_K_Out), .VG_K_Ena(A_K_Ena), .VG_L_Out(A_L_Out), .VG_L_Ena(A_L_Ena), .VG_M_Out(A_M_Out),
    .VG_M_Ena(A_M_Ena), .VG_N_Out(A_N_Out), .VG_N_Ena(A_N_Ena), .X_SelDirO(X_SelDirO), .X_EnIO(X_EnIO),
    .A_IO(A_IO), .B_IO(B_IO), .C_IO(C_IO));
  IO_BUFF inst29 (
    .sys_clk(sys_clk), .sys_reset(sys_reset), .HW_SEL_Mode(HW_sel_Mode), .FC(FC), .FC_Str(FC_STR),
    .SD_me_mm(SD_ME_MM), .FG_DDS_STR(FG_DDS_STR), .nIRQ(nIRQ), .nDRQ(nDRQ), .CLK_6MHZ(clk_6MHz),
    .Pu_Reset(sys_reset), .PowerUP_FlagR(PowerUP_Flag), .MB_A(MB_A), .MB_SubA(MB_SUBA), .MB_DOut(MB_Dout),
    .MB_SEL(MB_SEL), .MB_R_nW(MB_R_nW), .MB_nDS(MB_nDS), .MB_SEL_WR(MB_SEL_WR), .MB_CLK(MB_CLK),
    .MB_nReset(MB_nRESET), .FB_A(FB_A), .FB_nAdr_Sel(FB_nAdr_Sel), .FB_nBSel(FB_nBSEL), .FB_DOut(FB_D_Out),
    .FB_R_nW(FB_R_nW), .FB_nDS(FB_nDS), .FB_Ena_Tri_Buff(FB_Ena_Tri_Buff),
    .FB_nSel_Ext_Data_Drv(FB_nSel_Ext_Data_Drv), .FB_Ext_Data_Drv_WRnRd(FB_Ext_Data_Drv_WRnRd),
    .FB_nReset(FB_nRESET), .FB_nEVT_Str(nFair_Timing_Cycle), .V_Ain(V_Ain), .V_Bin(V_Bin), .V_Cin(V_Cin),
    .ENA_Every_20ms(Ena_Every20ms), .Ena_Every_100ns(Ena_Every100ns), .SW_in(SW), .SWF_in(SWF),
    .FG1x2_Funct(FG1x2_Funct), .FG112_DAC(FG112_DAC), .FG112_nACK(FG112_nACK), .FG112_nSTB(FG112_nSTB),
    .FG1x2_Res(FG112_Res), .FG122_addr(FG122_addr), .FG122_Data_out(FG122_Data_out), .FG122_DBRD(FG122_DBRD),
    .FG122_DBWR(FG122_DBWR), .FG122_Res(FG122_Res), .FG122_Funct(FG122_Funct), .FG112_nDRDY(FG112_nDRDY),
    .SCU_Sel_Err(nSEL_Err_FB), .MB_Sel_Err(nSEL_Err_MB), .FB_nINL(nINL_FB), .FB_nDRQ(nDRQ_FB),
    .FB_nDRDY(nDRDY_FB), .FG203_Mode(FG203_Mode), .FG203B_Mode(FG203B_Mode), .FB_nSRQ_SL(FB_nSRQ_SL),
    .FB_DIN(FB_D_In), .FB_nDTACK(FB_nDtack), .MB_nDTACK(MB_nDTACK), .MB_DIN(MB_DIN),
    .nSend_Ena(nEX_SEND_ENA_SYN), .nSend_Str(nEX_SEND_STR_SYN), .Sel_MB(HW_SEL_MB), .Sel_FB(HW_SEL_FB),
    .nDRQ_HW(nDRQ_IFA), .nDRDY_HW(nDRDY_IFA), .nINL_HW(nINL_IFA), .Sel_Err(Sel_Err), .nIACK(nIACK),
    .IFA_Adr(IFA_Adr), .STS(STS), .DIW(DIW), .VG_nSwitch_Ena(A_nSWITCH_Ena), .VG_A_Out(A_A_Out),
    .VG_A_nEn(A_A_Ena), .VG_B_Out(A_B_Out), .VG_B_nEn(A_B_Ena), .VG_C_Out(A_C_Out), .VG_C_nEn(A_C_Ena),
    .VG_D_Out(A_D_Out), .VG_D_nEn(A_D_Ena), .VG_E_Out(A_E_Out), .VG_E_nEn(A_E_Ena), .VG_F_Out(A_F_Out),
    .VG_F_nEn(A_F_Ena), .VG_G_Out(A_G_Out), .VG_G_nEn(A_G_Ena), .VG_I_Out(A_I_Out), .VG_I_nEn(A_I_Ena),
    .VG_K_Out(A_K_Out), .VG_K_nEn(A_K_Ena), .VG_L_Out(A_L_Out), .VG_L_nEn(A_L_Ena), .VG_M_Out(A_M_Out),
    .VG_M_nEn(A_M_Ena), .VG_N_Out(A_N_Out), .VG_N_nEn(A_N_Ena), .X_SelDirO(X_SelDirO), .X_EnIO(X_EnIO),
    .A_out(A_Aout), .B_out(A_Bout), .C_out(A_Cout), .A_out_en(A_OUT_en), .B_out_en(B_OUT_en),
    .C_out_en(C_OUT_en), .n_enInputs(nENInputs), .n_enOutputs(nENOutputs), .FG112_ADC(ADC_112),
    .FG112_nLH(FG112_nLH), .FG112_nOBF(FG112_nOBF), .FG112_LnH(FG112_LnH), .FG112_IBF(FG112_IBF_nDRQ),
    .FG112_nALARM(FG112_Alarm), .FG122_Data_in(FG122_Data_in), .AP_IO(AP_IO));  // open: Testout
  LED_out inst2 (
    .sys_clk(sys_clk), .sys_reset(sys_reset), .ENA_Every_20ms(Ena_Every20ms), .ENA_Every_1sec(Ena_Every1sec),
    .ENA_Every_2_5s(Ena_Every2_5s), .MB_virt_RW(MB_virt_RW), .IFA_Mode(IFA_Mode), .FG_Mode(FG_Mode),
    .FG_DDS_Mode(FG_DDS_Mode), .MB_Mode(MB_Mode), .Sweep_Mode(Sweep_Mode), .IFA_VERS(IFA_VERS),
    .Sweep_VERS(SWEEP_VERS), .MB_VERS(MB_VERS), .FG_VERS(FG_VERS), .FB_VERS(FB_VERS), .IFA_ADR(IFA_Adr),
    .LED_SEL_IN(FC_STR), .nLED_TRM_IN(A_MIL1_Out_ENA), .LED_RCV_IN(RCV_RDY_VW_L), .nLED_DRQ_IN(nDRQ),
    .nLED_DRDY_IN(nDRDY_IFA), .nLED_INL_IN(nINL_IFA), .UMIL15V(A_UMIL15V), .UMIL5V(A_UMIL5V),
    .FB_Mode(SCU_Mode), .PowerUP_Flag(PowerUP_Flag), .ME_Err_Limit(ME_Error_Limit), .JP_SEL_6408(1'b0),
    .Sync_Event_Ser_Str(Sync_Event_Ser_Str), .A_EXT_CLK(A_EXT_CLK), .USER_LED_in(1'b0),
    .FAILSAVE_LED_in(1'b0), .SHOW_CONFIG_in(1'b0), .nLED_out(A_nLED));
  assign A_TEST_CLK = Bus_FC_STR;  // WIRE inst3

  assign A_ME_UDI = 1'b0;
  assign A_Test = {16{1'b0}};
  assign FS_ASDI = 1'b0;
  assign FS_DCLK = 1'b0;
  assign FS_NCS = 1'b0;
  assign NOE_TST = 1'b0;

  // Other names for the same wires on the sheet: Ena_Every_1us = Ena_Every1us; Ena_Every_20ms = Ena_Every20ms;
  //   Ena_Every_100ns = Ena_Every100ns; Ena_Every_166ns = Ena_Every166ns; Ena_Every_250ns = Ena_Every250ns;
  //   Ena_Every_500ns = Ena_Every500ns; FG_CLK = A_CLK_FG; nLED[27:0] = A_nLED;
  //   VG_Control[11:0] = {A_N_Out, A_M_Out, A_L_Out, A_K_Out, A_I_Out, A_G_Out, A_F_Out, A_E_Out, A_D_Out, A_C_Out, A_B_Out, A_A_Out};
  //   VG_Control_E (some bits) = {A_nSWITCH_Ena, A_N_Ena, A_M_Ena, A_L_Ena, A_K_Ena, A_I_Ena, A_G_Ena, A_F_Ena, A_E_Ena, A_D_Ena, A_C_Ena, A_B_Ena, A_A_Ena}

  // Notes on the sheet:
  //   Text
  //   120MHz
  //   Text
  //   Text
  //   MCU-BUS
  //   Text
  //   TBD Leitung zur MCU 
  //   Text
  //   Text
  //   Text
  //   Text
  //   VG-Leiste
  //   Text
  //   MIL-Device encoder/Decoder IO
  //   Text
  //   Send data MUX
  //   text
  //   Test_ein_oder_aus
  //   MIL Serial-Output
  //   Externes EEPROM
  //   MIL Serial-Input
  //   Immer bipol
endmodule
